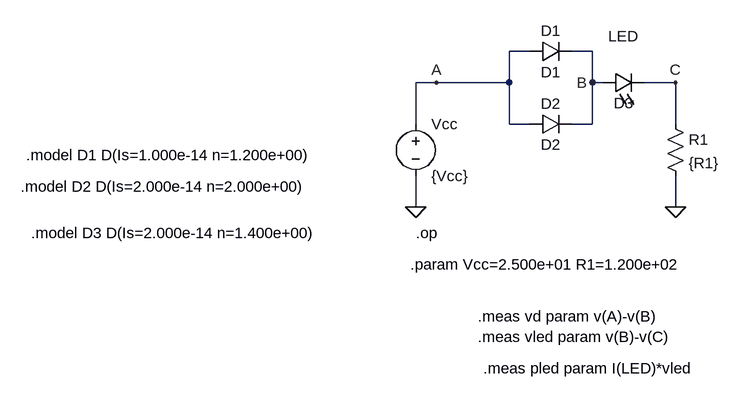
[diagram p0: schematic COMB00op.asc]
COMB00op.asc, the LTspice schematic file:
Version 4
SHEET 1 1608 1076
WIRE 1040 -192 1008 -192
WIRE 1136 -192 1104 -192
WIRE 896 -144 864 -144
WIRE 1008 -144 1008 -192
WIRE 1008 -144 896 -144
WIRE 1136 -144 1136 -192
WIRE 1152 -144 1136 -144
WIRE 1264 -144 1216 -144
WIRE 864 -80 864 -144
WIRE 1008 -80 1008 -144
WIRE 1040 -80 1008 -80
WIRE 1136 -80 1136 -144
WIRE 1136 -80 1104 -80
WIRE 1264 -80 1264 -144
WIRE 864 48 864 0
WIRE 1264 48 1264 0
FLAG 1264 48 0
FLAG 864 48 0
FLAG 896 -144 A
FLAG 1136 -144 B
FLAG 1264 -144 C
SYMBOL voltage 864 -96 R0
WINDOW 123 0 0 Left 0
WINDOW 39 0 0 Left 0
SYMATTR InstName Vcc
SYMATTR Value {Vcc}
SYMBOL res 1248 -96 R0
SYMATTR InstName R1
SYMATTR Value {R1}
SYMBOL LED 1152 -128 R270
WINDOW 0 72 32 VTop 2
WINDOW 3 0 32 VBottom 2
SYMATTR InstName LED
SYMATTR Value D3
SYMBOL diode 1040 -176 R270
WINDOW 0 32 32 VTop 2
WINDOW 3 0 32 VBottom 2
SYMATTR InstName D1
SYMATTR Value D1
SYMBOL diode 1040 -64 R270
WINDOW 0 32 32 VTop 2
WINDOW 3 0 32 VBottom 2
SYMATTR InstName D2
SYMATTR Value D2
TEXT 864 88 Left 2 !.op
TEXT 856 136 Left 2 !.param Vcc=2.500e+01 R1=1.200e+02
TEXT 264 -32 Left 2 !.model D1 D(Is=1.000e-14 n=1.200e+00)
TEXT 256 16 Left 2 !.model D2 D(Is=2.000e-14 n=2.000e+00)
TEXT 272 88 Left 2 !.model D3 D(Is=2.000e-14 n=1.400e+00)
TEXT 960 216 Left 2 !.meas vd param v(A)-v(B)
TEXT 960 248 Left 2 !.meas vled param v(B)-v(C)
TEXT 968 296 Left 2 !.meas pled param I(LED)*vled

The netlist it stands for:
* COMB00op.asc
Vcc A 0 {Vcc}
R1 C 0 {R1}
D§LED B C D3
D1 A B D1
D2 A B D2
.model D D
.lib standard.dio
.op
.param Vcc=2.500e+01 R1=1.200e+02
.model D1 D(Is=1.000e-14 n=1.200e+00)
.model D2 D(Is=2.000e-14 n=2.000e+00)
.model D3 D(Is=2.000e-14 n=1.400e+00)
.meas vd param v(A)-v(B)
.meas vled param v(B)-v(C)
.meas pled param I(LED)*vled
.backanno
.end